# EAGLE schematic Amplificador_Clase_A (EAGLE 9.1.1)
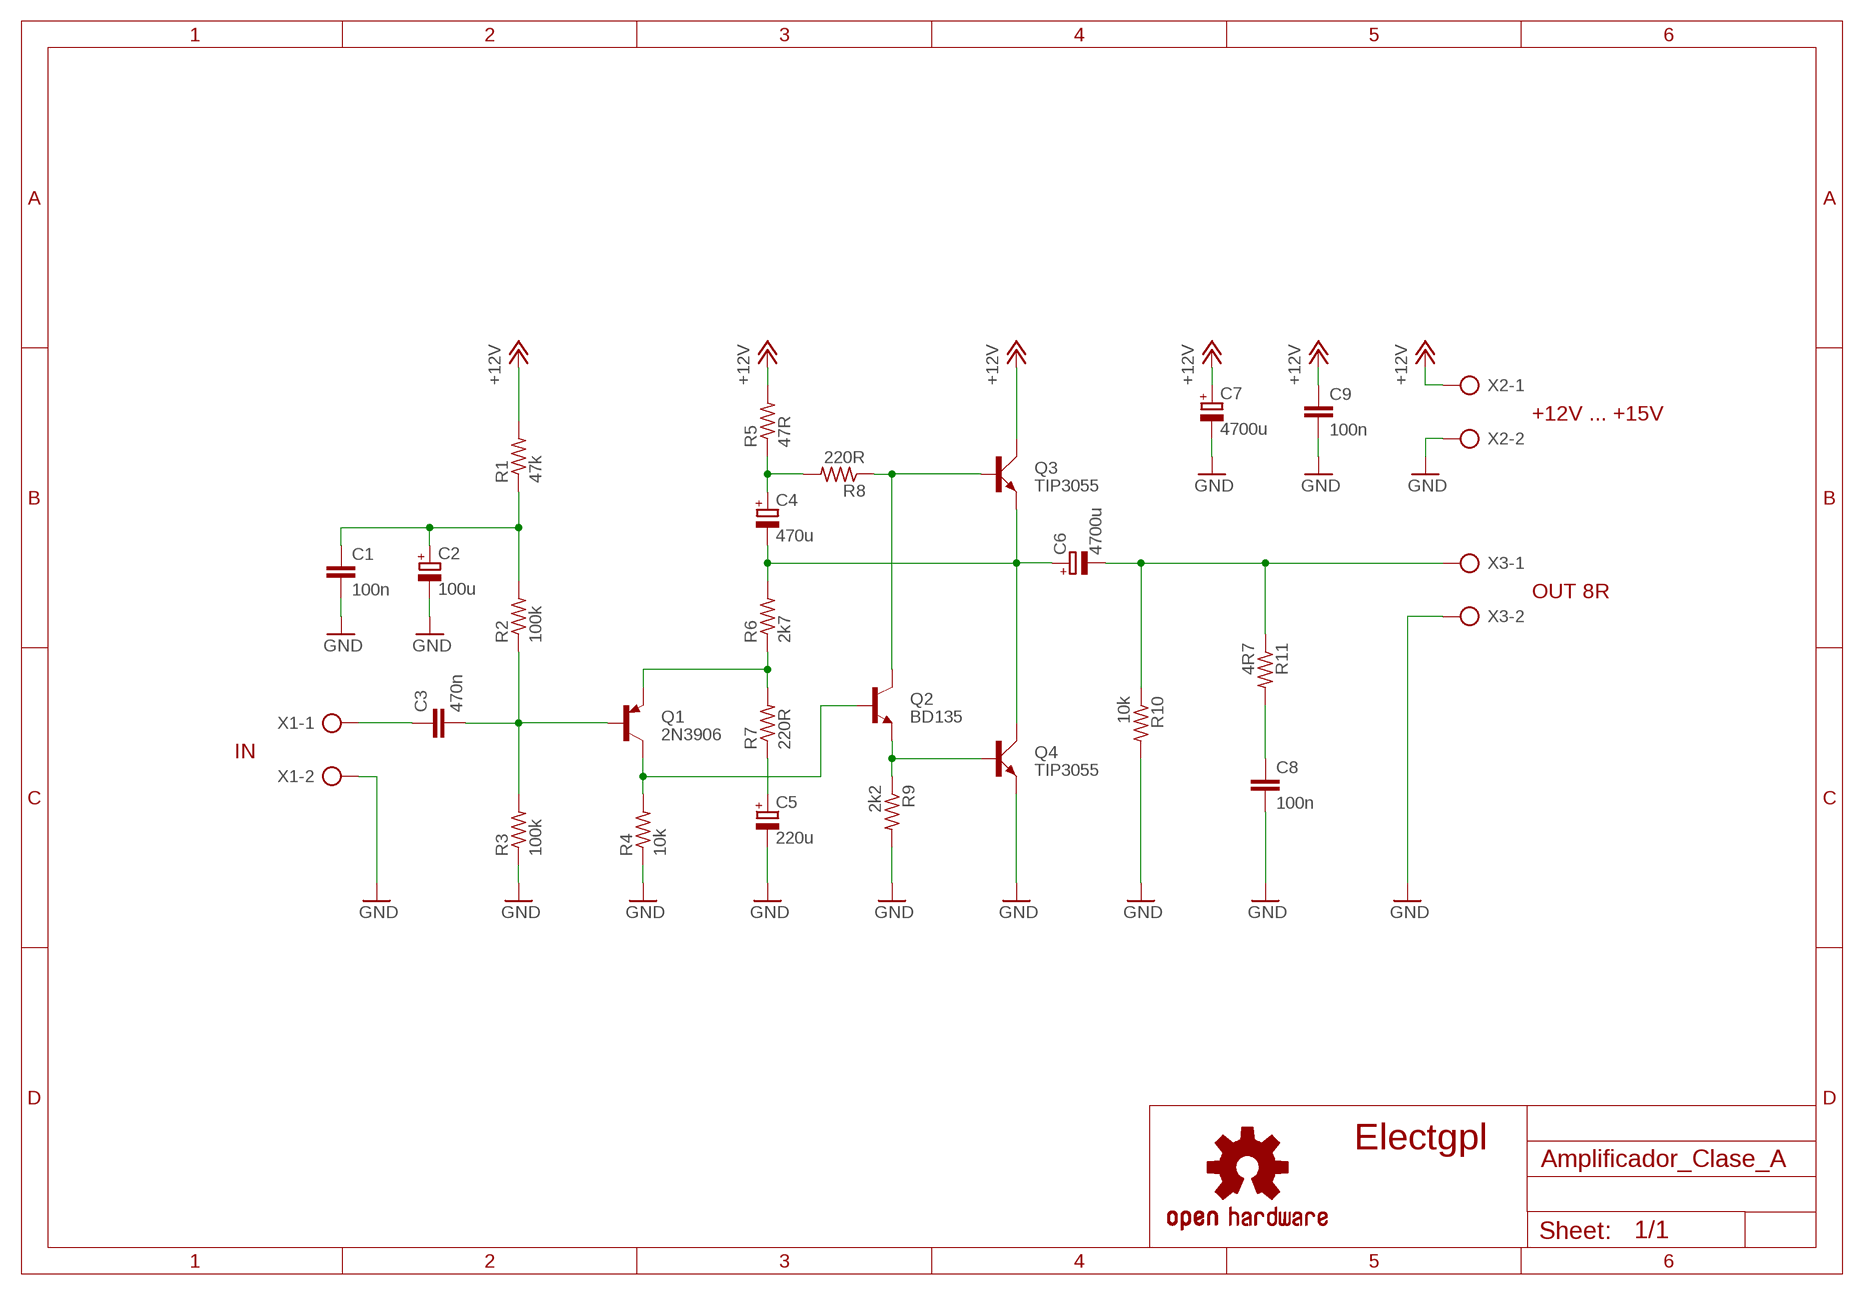
[diagram p0: schematic, sheet 1]

## Parts
C1  100n  C-EU050-024X044  [C050-024X044]
C2  100u  CPOL-EUE3.5-10  [E3,5-10]
C3  470n  C-EU050-024X044  [C050-024X044]
C4  470u  CPOL-EUE7.5-16  [E7,5-16]
C5  220u  CPOL-EUE3.5-10  [E3,5-10]
C6  4700u  CPOL-EUE7.5-16  [E7,5-16]
C7  4700u  CPOL-EUE7.5-16  [E7,5-16]
C8  100n  C-EU050-024X044  [C050-024X044]
C9  100n  C-EU050-024X044  [C050-024X044]
LOGO1  OSHW-LOGOM  [OSHW-LOGO-M]
Q1  2N3906  2N3906-PNP-TO92-EBC  [TO92-EBC]
Q2  BD135  -NPN-TO126V  [TO126V]
Q3  TIP3055  [TOP3AV]
Q4  TIP3055  [TOP3AV]
R1  47k  R-US_0207/12  [0207/12]
R2  100k  R-US_0207/12  [0207/12]
R3  100k  R-US_0207/12  [0207/12]
R4  10k  R-US_0207/12  [0207/12]
R5  47R  R-US_0207/12  [0207/12]
R6  2k7  R-US_0207/12  [0207/12]
R7  220R  R-US_0207/12  [0207/12]
R8  220R  R-US_0207/12  [0207/12]
R9  2k2  R-US_0207/12  [0207/12]
R10  10k  R-US_0207/12  [0207/12]
R11  4R7  R-US_0207/12  [0207/12]
X1  AK500/2  [AK500/2]
X2  AK500/2  [AK500/2]
X3  AK500/2  [AK500/2]

## Nets
+12V: C7.+ C9.1 Q3.C R1.2 R5.2 X2.1
GND: C1.2 C2.- C5.- C7.- C8.2 C9.2 Q4.E R3.1 R4.1 R9.2 R10.2 X1.2 X2.2 X3.2
N$1: C3.2 Q1.B R2.1 R3.2
N$2: C1.1 C2.+ R1.1 R2.2
N$3: Q1.C Q2.3(B) R4.2
N$4: C5.+ R7.1
N$5: Q1.E R6.1 R7.2
N$6: C4.- C6.+ Q3.E Q4.C R6.2
N$7: C4.+ R5.1 R8.2
N$8: Q2.2(C) Q3.B R8.1
N$9: Q2.1(E) Q4.B R9.1
N$10: C3.1 X1.1
N$11: C6.- R10.1 R11.1 X3.1
N$12: C8.1 R11.2

## Notes on the sheet
- +12V ... +15V
- OUT 8R
- IN
- Electgpl

## Library data of the parts
C1 C3 C8 C9 = rcl:C-EU: CAPACITOR, European symbol; SPICEPREFIX: C
C2 C4-C7 = rcl:CPOL-EU: POLARIZED CAPACITOR, European symbol; SPICEPREFIX: C
LOGO1 = SparkFun-Aesthetics:OSHW-LOGO: Open-Source Hardware (OSHW) Logo This logo indicates the piece of hardware it is found on incorporates a OSHW license and/or adheres to the definition of open source hardware found here: http://freedomdefined.org/OSHW
Q1 = transistor-neu-to92:*-PNP-: PNP Transistror
Q2 = transistor-neu-to92:*-NPN-: NPN Transistror
Q3 Q4 = transistor-power:TIP3055: NPN TRANSISTOR
R1-R11 = rcl:R-US_: RESISTOR, American symbol; SPICEPREFIX: R
X1-X3 = con-ptr500:AK500/2: CONNECTOR; OC_FARNELL: unknown; OC_NEWARK: unknown